# Altium schematic sheet Sheet4.SchDoc
size A
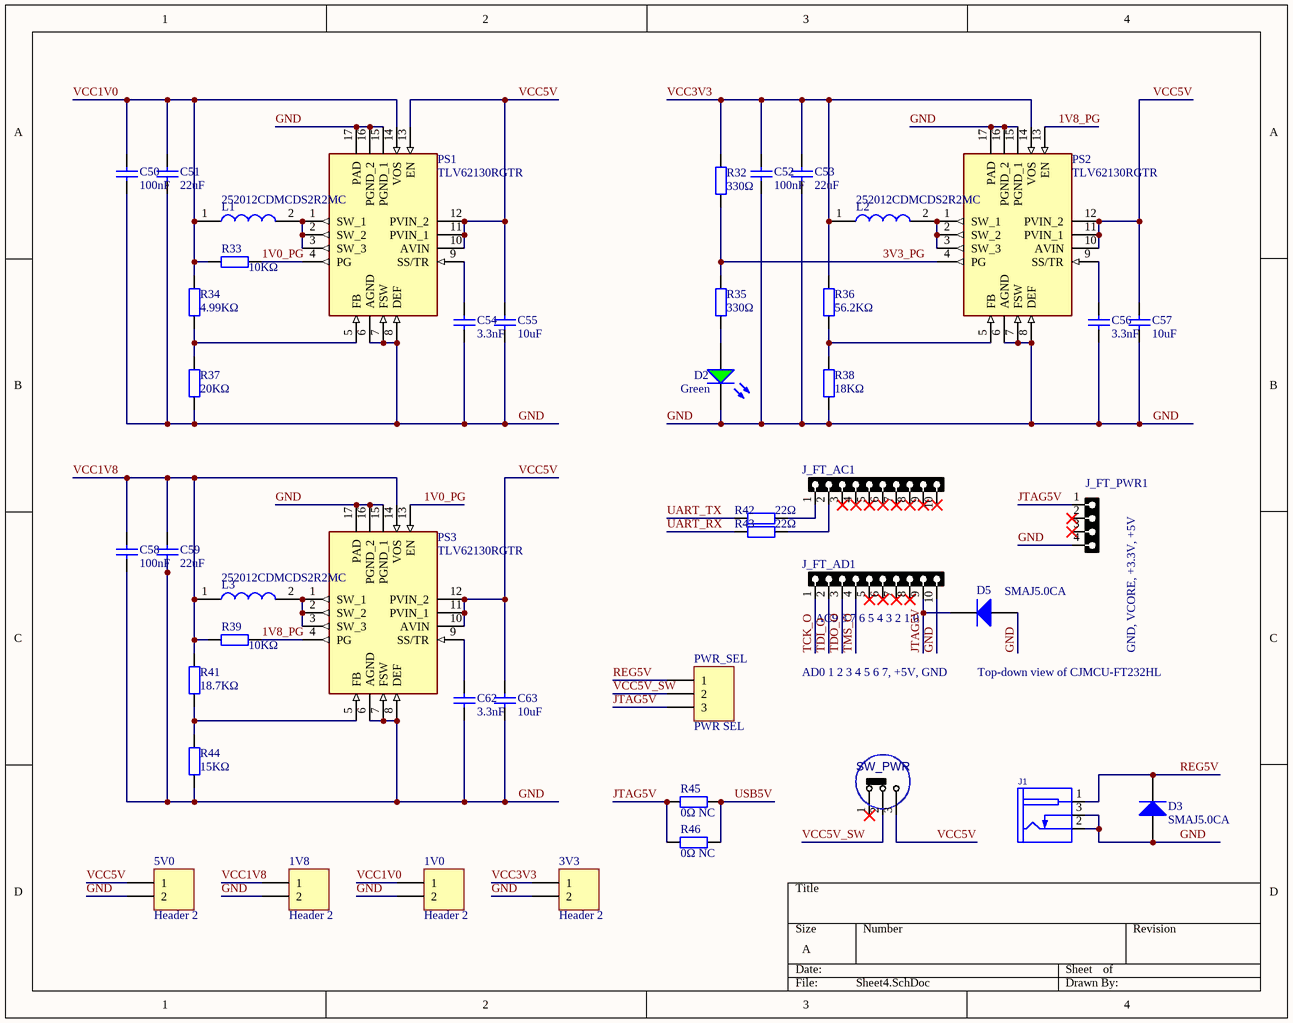
[diagram p0: Sheet4.SchDoc]

## Parts
1V0  Header 2  [HDR1X2]
1V8  Header 2  [HDR1X2]
3V3  Header 2  [HDR1X2]
5V0  Header 2  [HDR1X2]
C50  100nF  [1206_C]
C51  22uF  [0805_C]
C52  100nF  [1206_C]
C53  22uF  [0805_C]
C54  3.3nF  [0805_C]
C55  10uF  [1206_C]
C56  3.3nF  [0805_C]
C57  10uF  [1206_C]
C58  100nF  [1206_C]
C59  22uF  [0805_C]
C62  3.3nF  [0805_C]
C63  10uF  [1206_C]
D2  Green  [0805_LED_S1]
D3  SMAJ5.0CA  [SMA(DO-214AC)_S1]
D5  SMAJ5.0CA  [SMA(DO-214AC)_S1]
J1  DC_POWER_JACK  [JAC_PWR2MM]  (value not drawn)
J_FT_AC1  HDRF10  [HDR_F_1X10]  (value not drawn)
J_FT_AD1  HDRF10  [HDR_F_1X10]  (value not drawn)
J_FT_PWR1  HDRF4  [HDR_F_1X4]  (value not drawn)
L1  252012CDMCDS2R2MC  [INDPM2520X120N]
L2  252012CDMCDS2R2MC  [INDPM2520X120N]
L3  252012CDMCDS2R2MC  [INDPM2520X120N]
PS1  TLV62130RGTR  [QFN50P300X300X100-17N-D]
PS2  TLV62130RGTR  [QFN50P300X300X100-17N-D]
PS3  TLV62130RGTR  [QFN50P300X300X100-17N-D]
PWR_SEL  PWR SEL  [HDR1X3]
R32  330Ω  [0805_R]
R33  10KΩ  [1206_R]
R34  4.99KΩ  [0805_R]
R35  330Ω  [0805_R]
R36  56.2KΩ  [0805_R]
R37  20KΩ  [0805_R]
R38  18KΩ  [0805_R]
R39  10KΩ  [1206_R]
R41  18.7KΩ  [0805_R]
R42  22Ω  [1206_R]
R43  22Ω  [1206_R]
R44  15KΩ  [0805_R]
R45  0Ω NC  [0805_R]
R46  0Ω NC  [0805_R]
SW_PWR  SlideSwitch  [SWSLIDT_SPDT_S_8X4]  (value not drawn)

## Nets
1V0_PG: PS1.4(PG) PS3.13(EN) R33.2
1V8_PG: PS2.13(EN) PS3.4(PG) R39.2
3V3_PG: PS2.4(PG) R32.1 R35.2
GND: 1V0.2 1V8.2 3V3.2 5V0.2 C50.1 C51.1 C52.1 C53.1 C54.1 C55.1 C56.1 C57.1 C58.1 C59.1 C62.1 C63.1 D2.K D3.1(A) D5.1(A) J1.2(SLEEVE) J1.3(INSERTION_DET) J_FT_AD1.10 J_FT_PWR1.4 PS1.6(AGND) PS1.7(FSW) PS1.8(DEF) PS1.15(PGND_1) PS1.16(PGND_2) PS1.17(PAD) PS2.6(AGND) PS2.7(FSW) PS2.8(DEF) PS2.15(PGND_1) PS2.16(PGND_2) PS2.17(PAD) PS3.6(AGND) PS3.7(FSW) PS3.8(DEF) PS3.15(PGND_1) PS3.16(PGND_2) PS3.17(PAD) R37.1 R38.1 R44.1
JTAG5V: D5.2(K) J_FT_AD1.9 J_FT_PWR1.1 PWR_SEL.3 R45.1 R46.1
REG5V: D3.2(K) J1.1(TIP) PWR_SEL.1
TCK_O: J_FT_AD1.1
TDI_O: J_FT_AD1.2
TDO_O: J_FT_AD1.3
TMS_O: J_FT_AD1.4
UART_RX: R43.1
UART_TX: R42.1
USB5V: R45.2 R46.2
VCC1V0: 1V0.1 C50.2 C51.2 L1.1 PS1.14(VOS) R33.1 R34.2
VCC1V8: 1V8.1 C58.2 C59.2 L3.1 PS3.14(VOS) R39.1 R41.2
VCC3V3: 3V3.1 C52.2 C53.2 L2.1 PS2.14(VOS) R32.2 R36.2
VCC5V: 5V0.1 C55.2 C57.2 C63.2 PS1.10(AVIN) PS1.11(PVIN_1) PS1.12(PVIN_2) PS1.13(EN) PS2.10(AVIN) PS2.11(PVIN_1) PS2.12(PVIN_2) PS3.10(AVIN) PS3.11(PVIN_1) PS3.12(PVIN_2) SW_PWR.3(P4)
VCC5V_SW: PWR_SEL.2 SW_PWR.2(P3)
NetC54_2: C54.2 PS1.9(SS/TR)
NetC56_2: C56.2 PS2.9(SS/TR)
NetC62_2: C62.2 PS3.9(SS/TR)
NetD2_A: D2.A R35.1
NetJ_FT_AC1_1: J_FT_AC1.1 R42.2
NetJ_FT_AC1_2: J_FT_AC1.2 R43.2
NetL1_2: L1.2 PS1.1(SW_1) PS1.2(SW_2) PS1.3(SW_3)
NetL2_2: L2.2 PS2.1(SW_1) PS2.2(SW_2) PS2.3(SW_3)
NetL3_2: L3.2 PS3.1(SW_1) PS3.2(SW_2) PS3.3(SW_3)
NetPS1_5: PS1.5(FB) R34.1 R37.2
NetPS2_5: PS2.5(FB) R36.1 R38.2
NetPS3_5: PS3.5(FB) R41.1 R44.2

Not connected (* = marked no-connect by the designer): J_FT_AC1 3* 4* 5* 6* 7* 8* 9* 10*; J_FT_AD1 5* 6* 7* 8*; J_FT_PWR1 2* 3*; SW_PWR 1(P1)*

## Notes on the sheet
- AC9 8 7 6 5 4 3 2 1 0
- AD0 1 2 3 4 5 6 7, +5V, GND
- Top-down view of CJMCU-FT232HL
- (near J_FT_PWR1) GND, VCORE, +3.3V, +5V

## Library data of the parts
1V0 1V8 3V3 5V0 = Header 2: Header, 2-Pin; LatestRevisionDate: 17-Jul-2002; LatestRevisionNote: Re-released for DXP Platform.; Publisher: Altium Limited
C50 C52 C58 = 1206 100nF (104) 10% 50V: 贴片电容; ComponentLink1Description: 供应商链接; ComponentLink1URL: http://www.szlcsc.com/product/details_25237.html; Package: 1206; Supplier: LC; SuppliersPartNumber: C24497
C51 C53 C59 = 0805 22uF (226) 20% 25V: 贴片电容; ComponentLink1Description: 供应商链接; ComponentLink1URL: http://www.szlcsc.com/product/details_46786.html; Package: 0805; Supplier: LC; SuppliersPartNumber: C45783
C54 C56 C62 = 0805 3.3nF (332) 10% 50V: 贴片电容; ComponentLink1Description: 供应商链接; ComponentLink1URL: http://www.szlcsc.com/product/details_54191.html; Package: 0805; Supplier: LC; SuppliersPartNumber: C53175
C55 C57 C63 = 1206 10uF (106) 10% 50V: 贴片电容; ComponentLink1Description: 供应商链接; ComponentLink1URL: http://www.szlcsc.com/product/details_14236.html; Package: 1206; Supplier: LC; SuppliersPartNumber: C13585
D2 = 0805 翠绿: 发光二极管; ComponentLink1Description: 供应商链接; ComponentLink1URL: http://www.szlcsc.com/product/details_2670.html; Package: 0805; Supplier: LC; SuppliersPartNumber: C2297
D3 D5 = SMA(DO-214AC) SS210: 二极管 TVS; ComponentLink1Description: 供应商链接; ComponentLink1URL: http://www.szlcsc.com/product/details_15669.html; Package: SMA(DO-214AC); Supplier: LC; SuppliersPartNumber: C14996
J1 = CONN_PWR_JACK2MM: CONN, PWR JACK DC, PLUG DIAM 2.0MM RA THD; MANF: CUI STACK; MANF_P#: PJ-202A, PJ-002AH, PJ-102AH, KLDX-0202; VALUE: DC_POWER_JACK
J_FT_AC1 J_FT_AD1 = HDR_F_1X10: CONN, HEADER, Female, pitch: 2.54mm, 10POS; VALUE: HDRF10
J_FT_PWR1 = HDR_F_1X4: CONN, HEADER, Female, pitch: 2.54mm, 4POS; VALUE: HDRF4
L1-L3 = 252012CDMCDS2R2MC: Inductor; Manufacturer_Name: Sumida; Manufacturer_Part_Number: 252012CDMCDS‐2R2MC; Datasheet Link: https://products.sumida.com/products/pdf/252012CDMCDDS%20(en).pdf; Height: 1.2mm
PS1-PS3 = TLV62130RGTR: Power Supply; Manufacturer_Name: Texas Instruments; Datasheet Link: http://www.ti.com/lit/gpn/tlv62130; Height: 1mm; Manufacturer_Part_Number: TLV62130RGTR; Arrow Part Number: TLV62130RGTR; Arrow Price/Stock: https://www.arrow.com/en/products/tlv62130rgtr/texas-instruments; Mouser Part Number: 595-TLV62130RGTR; Mouser Price/Stock: https://www.mouser.co.uk/ProductDetail/Texas-Instruments/TLV62130RGTR?qs=2UFnnMkojnVB1OajUwDmow%3D%3D
PWR_SEL = Header 3: Header, 3-Pin; LatestRevisionDate: 17-Jul-2002; LatestRevisionNote: Re-released for DXP Platform.; Publisher: Altium Limited
R32 R35 = 0805 330Ω (3300) 1%: 贴片电阻; ComponentLink1Description: 供应商链接; ComponentLink1URL: http://www.szlcsc.com/product/details_18318.html; Package: 0805; Supplier: LC; SuppliersPartNumber: C17630
R33 R39 = 1206 10KΩ (1002) 1%: 贴片电阻; ComponentLink1Description: 供应商链接; ComponentLink1URL: http://www.szlcsc.com/product/details_18590.html; Package: 1206; Supplier: LC; SuppliersPartNumber: C17902
R34 = 0805 4.99KΩ (4991) 1%: 贴片电阻; ComponentLink1Description: 供应商链接; ComponentLink1URL: http://www.szlcsc.com/product/details_18365.html; Package: 0805; Supplier: LC; SuppliersPartNumber: C17677
R36 = 0805 56KΩ (5602) 1%: 贴片电阻 56.2k; ComponentLink1Description: 供应商链接; ComponentLink1URL: http://www.szlcsc.com/product/details_18444.html; Package: 0805; Supplier: LC; SuppliersPartNumber: C17756
R37 = 0805 20KΩ (2002) 1%: 贴片电阻; ComponentLink1Description: 供应商链接; ComponentLink1URL: http://www.szlcsc.com/product/details_4735.html; Package: 0805; Supplier: LC; SuppliersPartNumber: C4328
R38 = 0805 18KΩ (1802) 1%: 贴片电阻; ComponentLink1Description: 供应商链接; ComponentLink1URL: http://www.szlcsc.com/product/details_18194.html; Package: 0805; Supplier: LC; SuppliersPartNumber: C17506
R41 = 0805 18KΩ (1802) 1%: 贴片电阻 18.7k; ComponentLink1Description: 供应商链接; ComponentLink1URL: http://www.szlcsc.com/product/details_18194.html; Package: 0805; Supplier: LC; SuppliersPartNumber: C17506
R42 R43 = 1206 22Ω (22R0) 1%: 贴片电阻; ComponentLink1Description: 供应商链接; ComponentLink1URL: http://www.szlcsc.com/product/details_18646.html; Package: 1206; Supplier: LC; SuppliersPartNumber: C17958
R44 = 0805 15KΩ (1502) 1%: 贴片电阻; ComponentLink1Description: 供应商链接; ComponentLink1URL: http://www.szlcsc.com/product/details_18163.html; Package: 0805; Supplier: LC; SuppliersPartNumber: C17475
R45 R46 = 0805 0Ω (0R0) 1%: 贴片电阻; ComponentLink1Description: 供应商链接; ComponentLink1URL: http://www.szlcsc.com/product/details_18165.html; Package: 0805; Supplier: LC; SuppliersPartNumber: C17477
SW_PWR = SWSLIDT_SPDT_S_8X4: SWITCH, SLIDE, SPDT, 8.6X4.3mm, THD; MANF_PART#: OS102011MS2QN1; MANF: C&K; DESC: DESCRIPTION; VALUE: SlideSwitch; ASSEMBLY: ASSEMBLY; PARAM: PARAM; PRICE: 0.4$